# EAGLE design i2c (EAGLE 7.4.0)
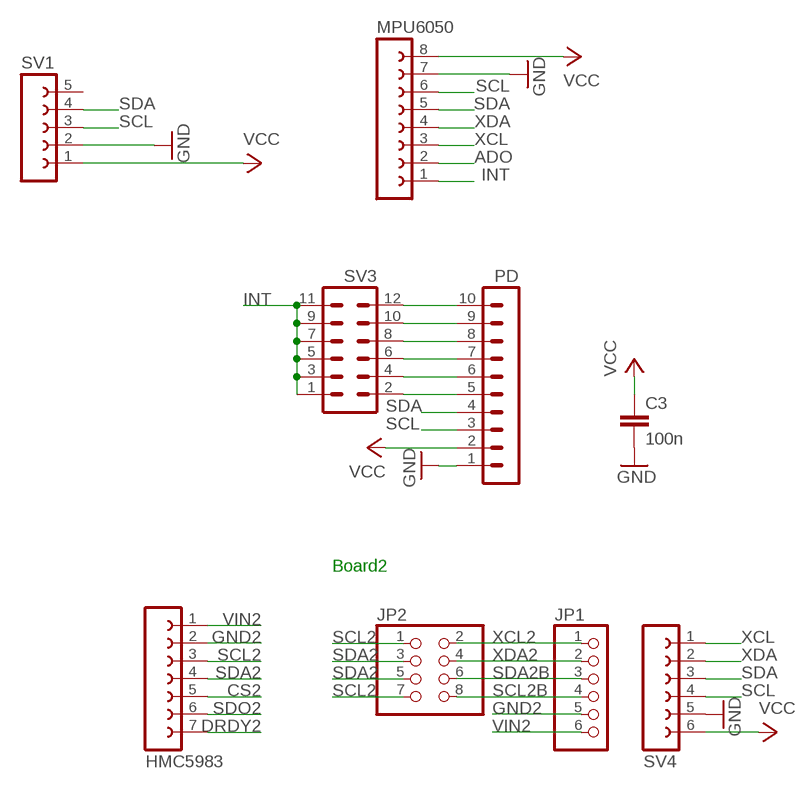
[diagram p0: schematic, sheet 1]

## Parts
C3  100n  C-EU025-024X044  [C025-024X044]
HMC5983  FE07-1  [FE07]
JP1  PINHD-1X6/90  [1X06/90]
JP2  PINHD-2X4  [2X04]
MPU6050  FE08W  [FE08W]
PD  MA10-1W  [MA10-1W]
SV1  FE05-1  [FE05-1]
SV3  MA06-2  [MA06-2]
SV4  FE06-1  [FE06]

## Nets
ADO: MPU6050.2
CS2: HMC5983.5
DRDY2: HMC5983.7
GND: C3.2 MPU6050.7 PD.1 SV1.2 SV4.5
GND2: HMC5983.2 JP1.5
INT: MPU6050.1 SV3.1 SV3.3 SV3.5 SV3.7 SV3.9 SV3.11
N$2: PD.10 SV3.12
N$3: PD.9 SV3.10
N$4: PD.8 SV3.8
N$5: PD.7 SV3.6
N$6: PD.6 SV3.4
N$7: PD.5 SV3.2
SCL: MPU6050.6 PD.3 SV1.3 SV4.4
SCL2: HMC5983.3 JP2.1 JP2.7
SCL2B: JP1.4 JP2.8
SDA: MPU6050.5 PD.4 SV1.4 SV4.3
SDA2: HMC5983.4 JP2.3 JP2.5
SDA2B: JP1.3 JP2.6
SDO2: HMC5983.6
VCC: C3.1 MPU6050.8 PD.2 SV1.1 SV4.6
VIN2: HMC5983.1 JP1.6
XCL: MPU6050.3 SV4.1
XCL2: JP1.1 JP2.2
XDA: MPU6050.4 SV4.2
XDA2: JP1.2 JP2.4
Unconnected: SV1.5

## Notes on the sheet
- Board2

## Library data of the parts
C3 = rcl:C-EU: CAPACITOR, European symbol
HMC5983 = con-lsta:FE07-1: FEMALE HEADER; OC_FARNELL: unknown; OC_NEWARK: unknown
JP1 = pinhead:PINHD-1X6: PIN HEADER
JP2 = pinhead:PINHD-2X4: PIN HEADER
MPU6050 = con-lsta:FE08W: FEMALE HEADER; OC_FARNELL: unknown; OC_NEWARK: unknown
PD = con-lstb:MA10-1W: PIN HEADER
SV1 = con-lsta:FE05-1: FEMALE HEADER; OC_FARNELL: unknown; OC_NEWARK: unknown
SV3 = con-lstb:MA06-2: PIN HEADER; OC_FARNELL: unknown; OC_NEWARK: unknown
SV4 = con-lsta:FE06-1: FEMALE HEADER; OC_FARNELL: unknown; OC_NEWARK: unknown

## Board
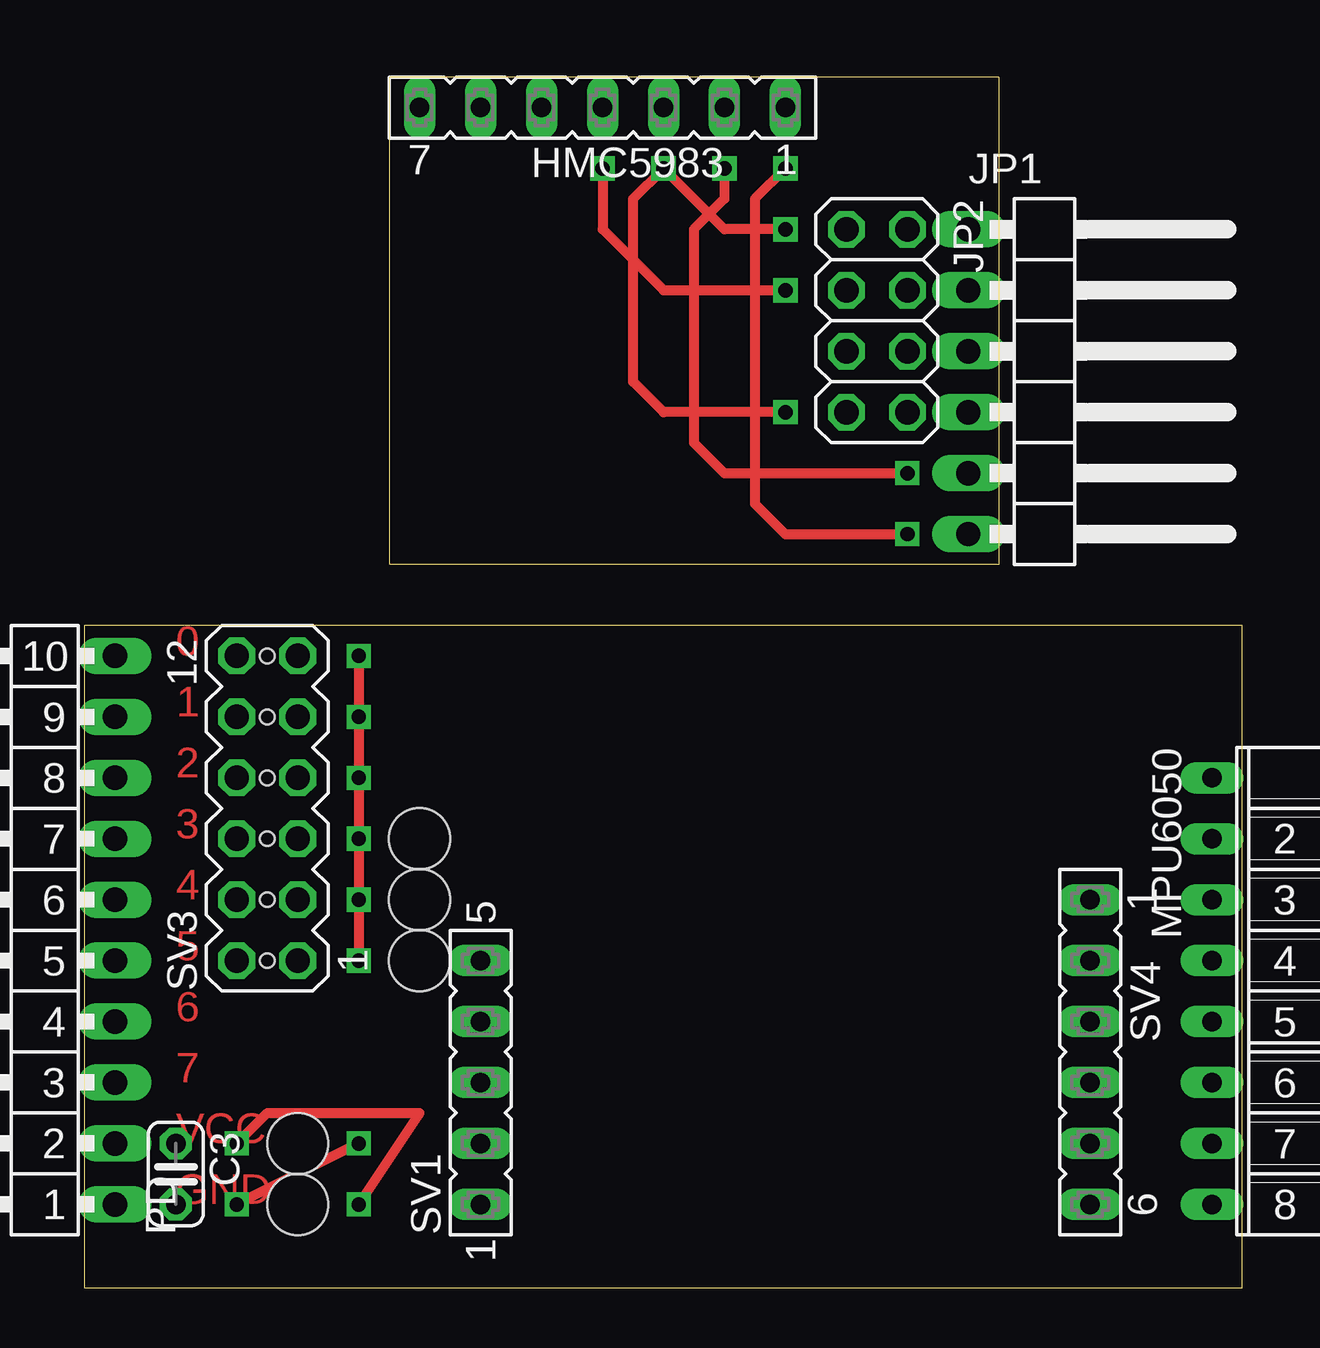
[diagram p1: board, top side]
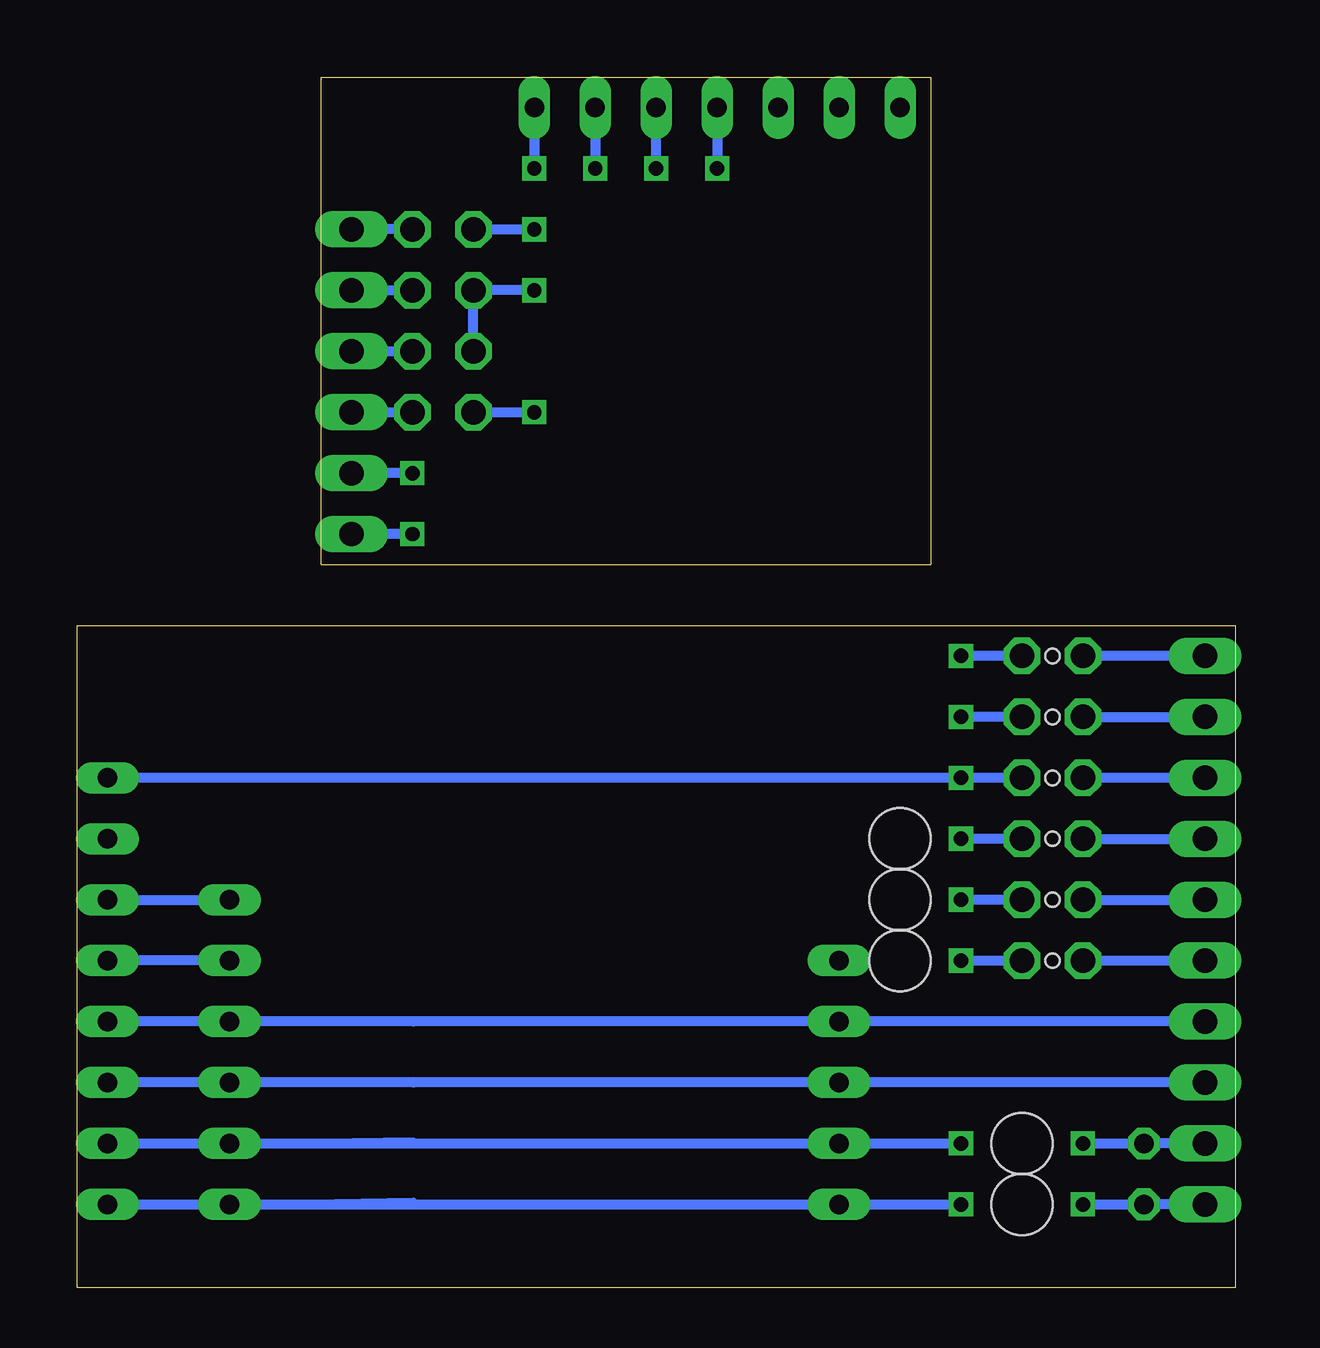
[diagram p2: board, bottom side, seen from below]

Size 48.25 x 50.47 mm. Coordinates in mm from the lower left corner, seen from the top.
Outline: 38.09,50.47 12.7,50.47
Outline: 38.09,30.15 12.7,30.15 12.7,50.46
Outline: 38.1,50.46 38.1,30.15
Outline: 0,27.61 0,0 48.25,0 48.25,27.61 0,27.61
Copper layers (1*16): Top 0.035mm / dielectric 1.5mm / Bottom 0.035mm
Design rules "default": minimum track width 10mil, minimum drill 24mil, track to track 8mil, track to pad 8mil, pad to pad 8mil, via to via 8mil, smd to smd 8mil, copper to edge 40mil, drill to drill 8mil, minimum pad ring 10mil, minimum via ring 8mil, stop-mask expansion 4mil, vias tented up to drill 0mil, thermal gap 10mil
Holes 2.54 mm at 13.97,18.72 13.97,16.18 13.97,13.64 8.89,6.02 8.89,3.48
Holes 0.6 mm at 7.62,26.34 7.62,23.8 7.62,21.26 7.62,18.72 7.62,16.18 7.62,13.64

### Footprints (pad centres in the part's own frame; a part is rotated, then mirrored left to right if it is on the bottom)
C025-024X044 = drill 0.813 octagon: 1 -1.27,0; 2 1.27,0
FE07 = drill 0.813 long: 1 -7.62,0; 2 -5.08,0; 3 -2.54,0; 4 0,0; 5 2.54,0; 6 5.08,0; 7 7.62,0
1X06/90 = drill 1.016 long: 1 -6.35,-3.81; 2 -3.81,-3.81; 3 -1.27,-3.81; 4 1.27,-3.81; 5 3.81,-3.81; 6 6.35,-3.81
2X04 = drill 1.016 octagon: 1 -3.81,-1.27; 2 -3.81,1.27; 3 -1.27,-1.27; 4 -1.27,1.27; 5 1.27,-1.27; 6 1.27,1.27; 7 3.81,-1.27; 8 3.81,1.27
FE08W = drill 0.813 long: 1 -8.89,0; 2 -6.35,0; 3 -3.81,0; 4 -1.27,0; 5 1.27,0; 6 3.81,0; 7 6.35,0; 8 8.89,0
MA10-1W = drill 1.016 long: 1 -11.43,0; 2 -8.89,0; 3 -6.35,0; 4 -3.81,0; 5 -1.27,0; 6 1.27,0; 7 3.81,0; 8 6.35,0; 9 8.89,0; 10 11.43,0
FE05-1 = drill 0.813 long: 1 -5.08,0; 2 -2.54,0; 3 0,0; 4 2.54,0; 5 5.08,0
MA06-2 = drill 1.016 octagon: 1 -6.35,-1.27; 2 -6.35,1.27; 3 -3.81,-1.27; 4 -3.81,1.27; 5 -1.27,-1.27; 6 -1.27,1.27; 7 1.27,-1.27; 8 1.27,1.27; 9 3.81,-1.27; 10 3.81,1.27; 11 6.35,-1.27; 12 6.35,1.27
FE06 = drill 0.813 long: 1 -6.35,0; 2 -3.81,0; 3 -1.27,0; 4 1.27,0; 5 3.81,0; 6 6.35,0

### Placement (x,y rotation side)
C3  3.81,4.75 270 top
HMC5983  21.59,49.2 180 top
JP1  40.64,37.77 270 top
JP2  33.02,40.31 270 top
MPU6050  46.99,12.37 270 top
PD  1.27,14.91 90 top
SV1  16.51,8.56 90 top
SV3  7.62,19.99 90 top
SV4  41.91,9.83 270 top

### Tracks (layer width: path | path; a pad name or v marks a point on that pad's centre or on a via)
GND  (via drill 0.6)
  Top 0.406: v11.43,6.02 v6.35,3.48
  Bottom 0.254: SV4.5 34.24,6.15 34.24,6.02
  Bottom 0.406: PD.1 C3.2 v6.35,3.48 | MPU6050.7 SV4.5 34.24,6.02 SV1.2 v11.43,6.02
GND2  (via drill 0.6)
  Top 0.406: v26.67,46.66 26.67,45.39 25.4,44.12 25.4,35.23 26.67,33.96 v34.29,33.96
  Bottom 0.406: HMC5983.2 v26.67,46.66 | v34.29,33.96 JP1.5
INT  (via drill 0.6)
  Top 0.406: v11.43,26.34 v11.43,23.8 v11.43,21.26 v11.43,18.72 v11.43,16.18 v11.43,13.64
  Bottom 0.406: SV3.7 v11.43,21.26 MPU6050.1 | SV3.11 v11.43,26.34 | v11.43,13.64 SV3.1 | SV3.3 v11.43,16.18 | SV3.5 v11.43,18.72 | SV3.9 v11.43,23.8
N$2
  Bottom 0.406: PD.10 SV3.12
N$3
  Bottom 0.406: SV3.10 PD.9
N$4
  Bottom 0.406: PD.8 SV3.8
N$5
  Bottom 0.406: SV3.6 PD.7
N$6
  Bottom 0.406: SV3.4 PD.6
N$7
  Bottom 0.406: SV3.2 PD.5
SCL
  Bottom 0.254: SV4.4 34.24,8.66 34.24,8.56
  Bottom 0.406: PD.3 SV1.3 34.24,8.56 SV4.4 MPU6050.6
SCL2  (via drill 0.6)
  Top 0.406: v29.21,36.5 24.13,36.5 22.86,37.77 22.86,45.39 v24.13,46.66 26.67,44.12 v29.21,44.12
  Bottom 0.406: JP2.7 v29.21,36.5 | v24.13,46.66 HMC5983.3 | JP2.1 v29.21,44.12
SCL2B
  Bottom 0.406: JP1.4 JP2.8
SDA
  Bottom 0.254: SV4.3 34.24,11.18 34.24,11.1
  Bottom 0.406: PD.4 SV1.4 34.24,11.1 SV4.3 MPU6050.5
SDA2  (via drill 0.6)
  Top 0.406: v29.21,41.58 24.13,41.58 21.59,44.12 v21.59,46.66
  Bottom 0.406: JP2.5 JP2.3 v29.21,41.58 | HMC5983.4 v21.59,46.66
SDA2B
  Bottom 0.406: JP1.3 JP2.6
VCC  (via drill 0.6)
  Top 0.406: v6.35,6.02 7.62,7.29 13.97,7.29 v11.43,3.48
  Bottom 0.254: SV4.6 34.24,3.63 34.24,3.48
  Bottom 0.406: PD.2 C3.1 v6.35,6.02 | MPU6050.8 SV4.6 34.24,3.48 SV1.1 v11.43,3.48
VIN2  (via drill 0.6)
  Top 0.406: v29.21,46.66 27.94,45.39 27.94,32.69 29.21,31.42 v34.29,31.42
  Bottom 0.406: HMC5983.1 v29.21,46.66 | v34.29,31.42 JP1.6
XCL
  Bottom 0.406: MPU6050.3 SV4.1
XCL2
  Bottom 0.406: JP2.2 JP1.1
XDA
  Bottom 0.406: SV4.2 MPU6050.4
XDA2
  Bottom 0.406: JP1.2 JP2.4

### Text on the board
Top: 0 | 1 | 2 | 3 | 4 | 5 | 6 | 7 | VCC | GND
tDocu: slave | slave | master | master | HMC5983 | MPU6050 | INT | HMC5983 | BMP180 | SDA | SCL | GND | VCC